# Altium schematic sheet PIN_Gamma_Topsheet.SchDoc: PIN Gamma Top
size A; Revision: A; SheetNumber: 1; SheetTotal: 3
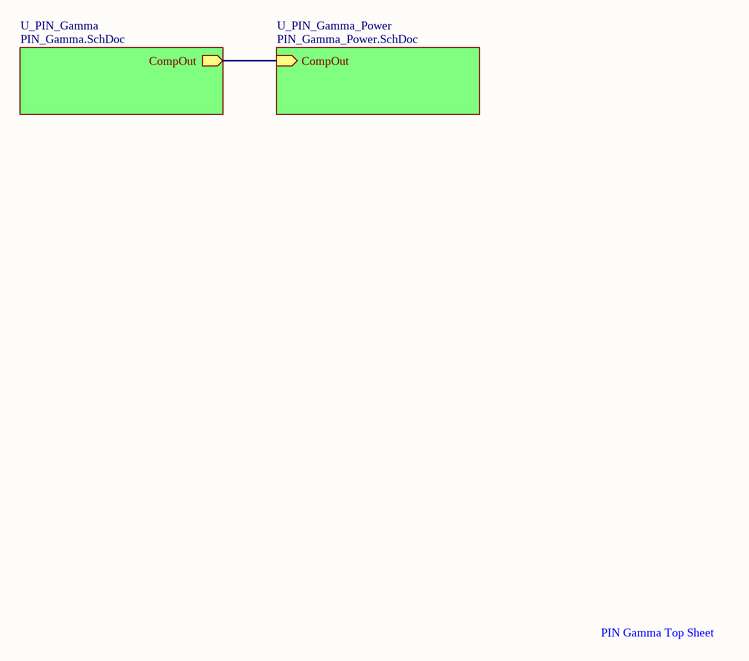
[diagram p0: PIN_Gamma_Topsheet.SchDoc]

## Sub-sheets
U_PIN_Gamma = PIN_Gamma.SchDoc: CompOut (out)
U_PIN_Gamma_Power = PIN_Gamma_Power.SchDoc: CompOut (in)

## Nets
(unnamed): sheet U_PIN_Gamma/CompOut, sheet U_PIN_Gamma_Power/CompOut

## Notes on the sheet
- PIN Gamma Top Sheet